# EasyEDA schematic SCH_Project-30-easy-XIAO_2026-04-27.json
TITLE: Sheet_1; REV: 1.0; Date: 2024-11-25; Sheet: 1/1; Drawn By: renatobrant; Company: Your Company
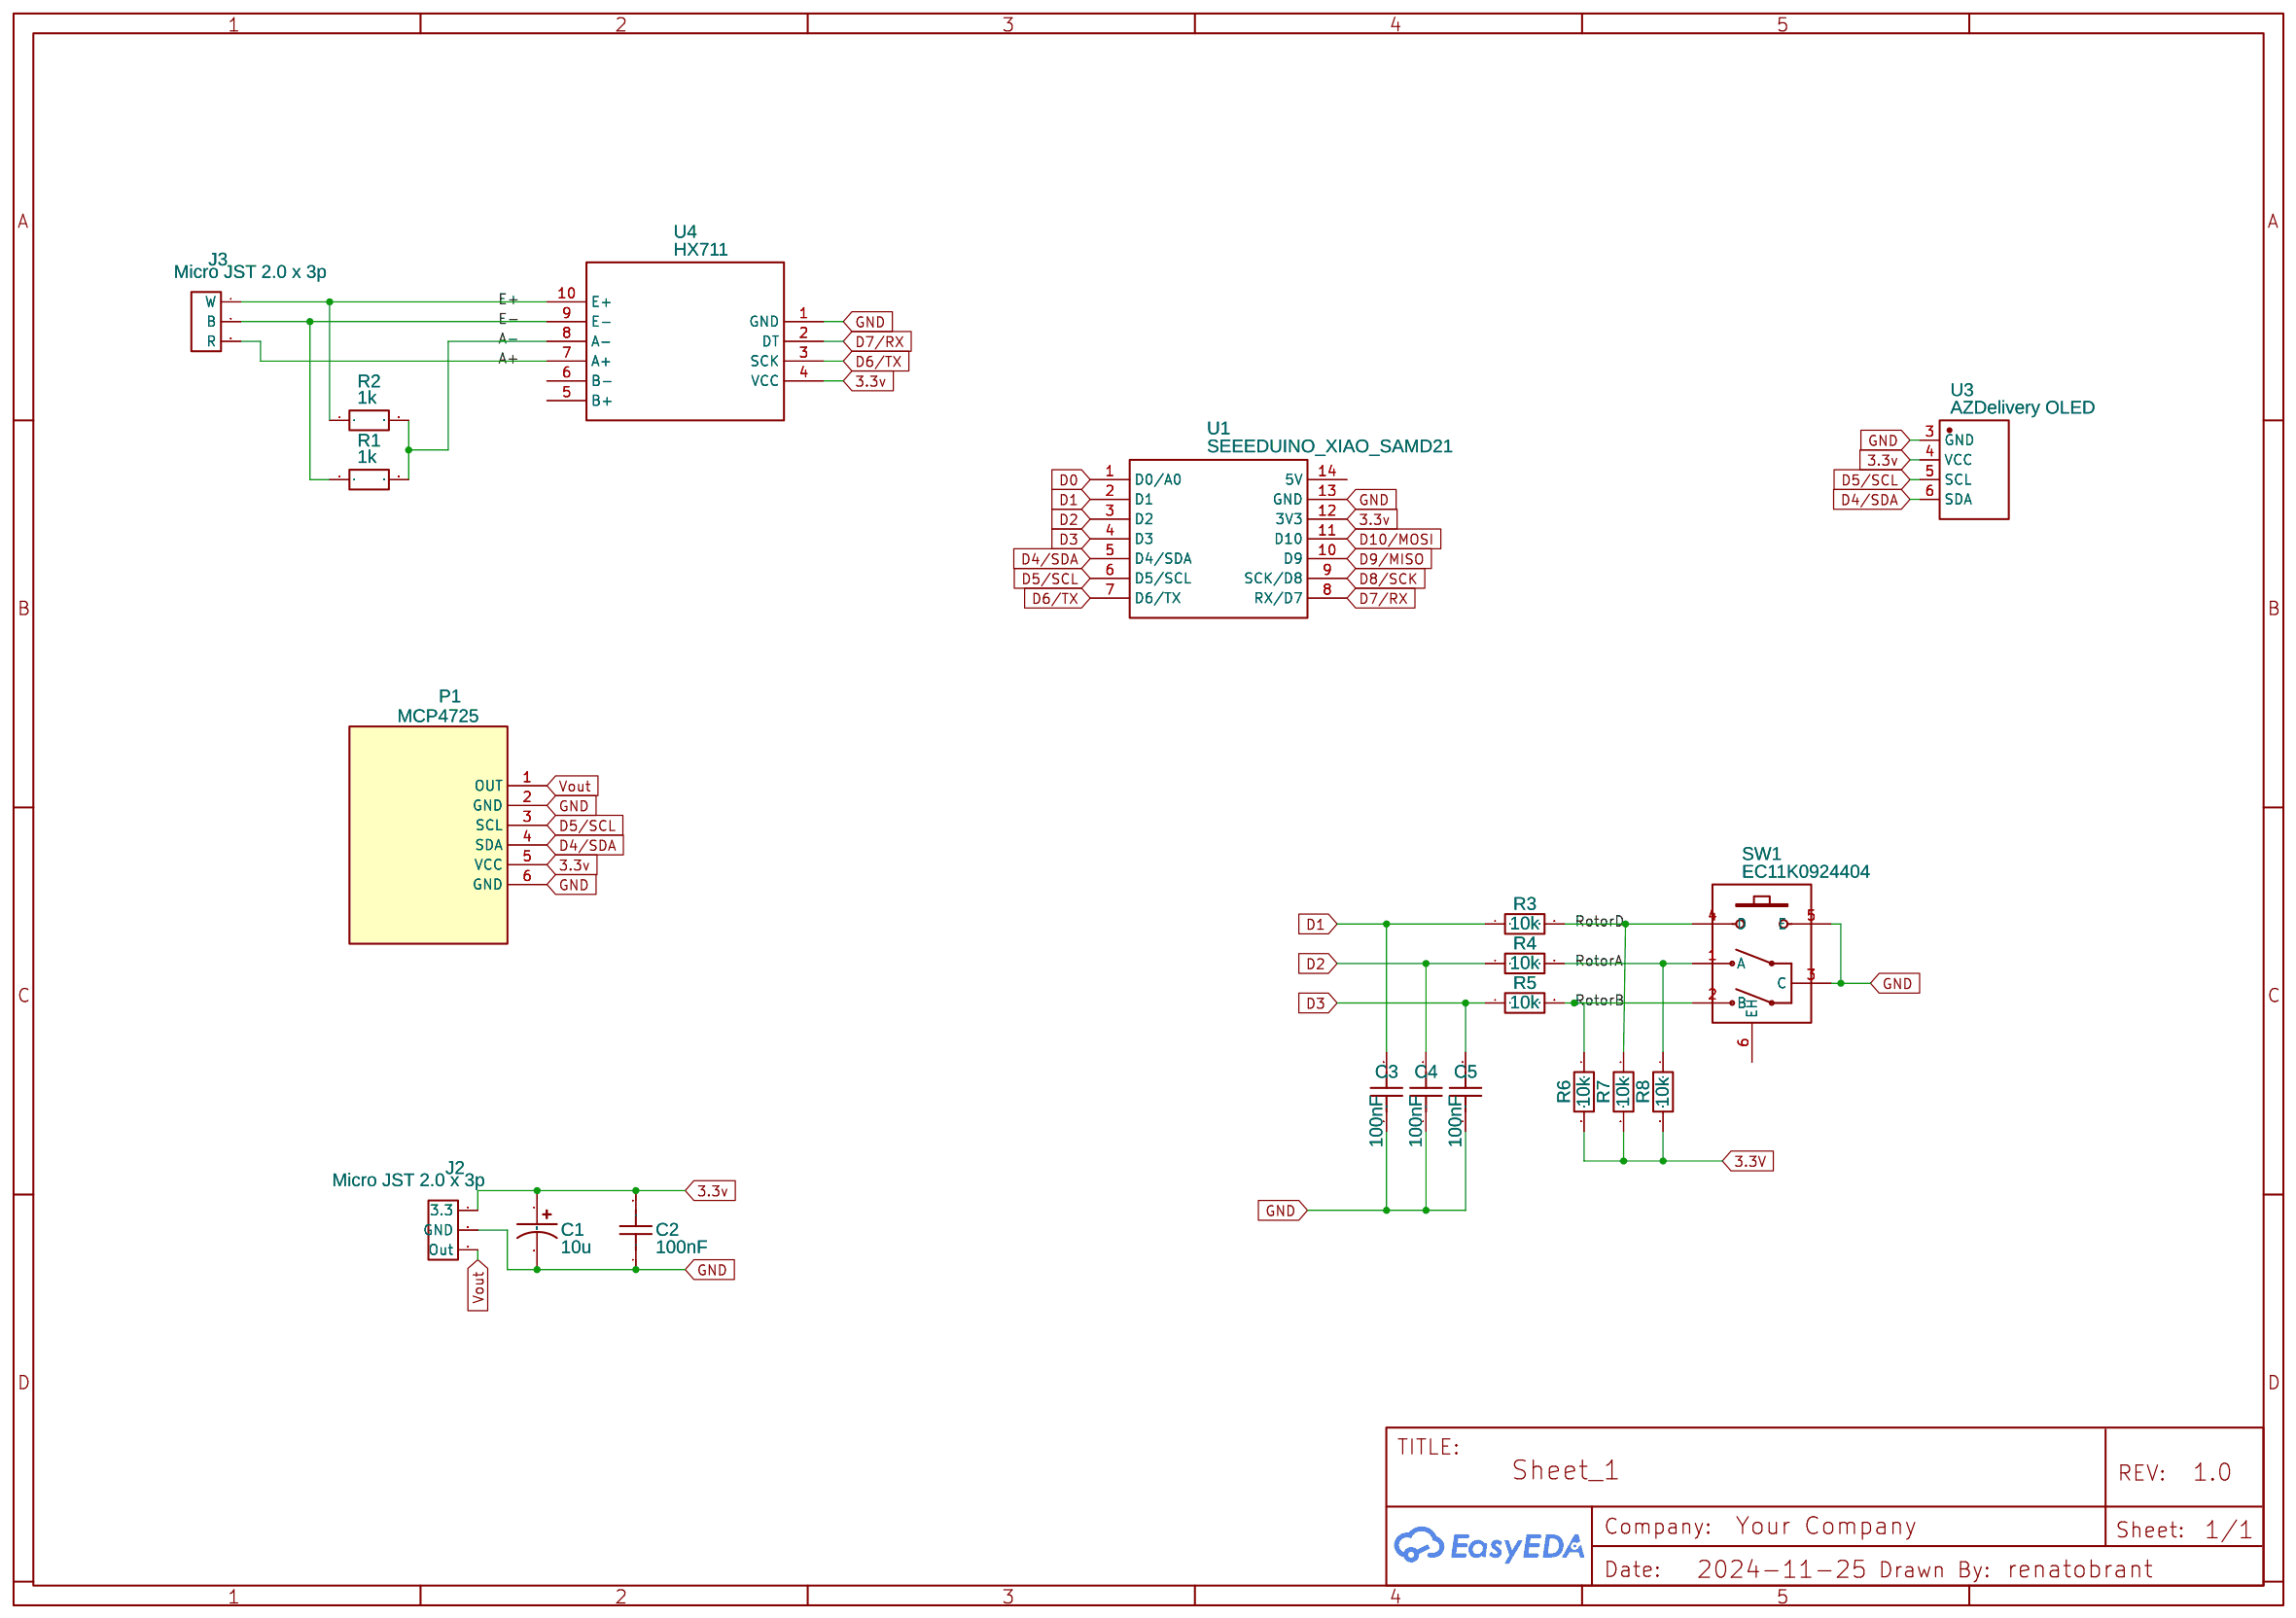
[diagram p0: schematic sheet]

## Parts
C1  10u  [CAP-D5.0×F2.0]
C2  100nF  [RAD-0.1]
C3  100nF  [RAD-0.1]
C4  100nF  [RAD-0.1]
C5  100nF  [RAD-0.1]
J2  Micro JST 2.0 x 3p  [MICRO JST2.0 X 3]
J3  Micro JST 2.0 x 3p  [MICRO JST2.0 X 3]
P1  MCP4725  [MCP4725-B]
R1  1k  [R_AXIAL-0.3]
R2  1k  [R_AXIAL-0.3]
R3  10k  [R_AXIAL-0.3]
R4  10k  [R_AXIAL-0.3]
R5  10k  [R_AXIAL-0.3]
R6  10k  [R_AXIAL-0.3]
R7  10k  [R_AXIAL-0.3]
R8  10k  [R_AXIAL-0.3]
SW1  EC11K0924404  [SW-TH_EC11K0924404]
U1  SEEEDUINO_XIAO_SAMD21  [SEEEDUINO_XIAO_SAMD21_R2]
U3  AZDelivery OLED  [OLED-TH_OLED0.96-I2C]
U4  HX711  [COMM-TH_HX711_01]

## Library data of the parts
C1 = CE_TH_D5.0×F2.0_US: Contributor: LCEDA_Lib
C2-C5 = C_RAD-0.1_US: Contributor: LCEDA_Lib
J2 J3 = Micro JST 2.0 x 3p: Contributor: BrIs1063
P1 = MCP4725 COPY: sourceId: 1T5FDZYC8
R1-R8 = R_AXIAL-0.3_EU: Contributor: LCEDA_Lib
SW1 = EC11K0924404: Contributor: LCSC; Supplier: LCSC; Supplier Part: C470743; Manufacturer: ALPSALPINE(阿尔卑斯阿尔派); JLCPCB Part Class: Extended Part
U1 = SEEEDUINO_XIAO_SAMD21: Contributor: jgm26
U3 = AZDelivery OLED: Supplier Part: AZDelivery; Manufacturer: AZDelivery; Manufacturer Part: ZJY096S0700BG01蓝色; link: https://img.jlc.com/pdf/applyPasteComponent/2022-08-15/203417A/337c2d88c1b34c958220578f8c1ccd46/ZJY096S0700WG01.pdf; Contributor: tonysandberg69
U4 = HX711: Contributor: lucasr.rbarros76

## Nets
3.3v: C1.1 C2.2 J2.1(3.3) P1.5(VCC) U1.12(3V3) U3.4(VCC) U4.4(VCC)
3.3V: R6.2 R7.2 R8.2
GND: C1.2 C2.1 C3.1 C4.1 C5.1 J2.2(GND) P1.2(GND) P1.6(GND) SW1.3(C) SW1.5(E) U1.13(GND) U3.3(GND) U4.1(GND)
A+: J3.3(R) U4.7(A+)
A-: R1.2 R2.2 U4.8(A-)
D0: U1.1(D0/A0)
D1: C3.2 R3.1 U1.2(D1)
D2: C4.2 R4.1 U1.3(D2)
D3: C5.2 R5.1 U1.4(D3)
D4/SDA: P1.4(SDA) U1.5(D4/SDA) U3.6(SDA)
D5/SCL: P1.3(SCL) U1.6(D5/SCL) U3.5(SCL)
D6/TX: U1.7(D6/TX) U4.3(SCK)
D7/RX: U1.8(RX/D7) U4.2(DT)
D8/SCK: U1.9(SCK/D8)
D9/MISO: U1.10(D9)
D10/MOSI: U1.11(D10)
E+: J3.1(W) R2.1 U4.10(E+)
E-: J3.2(B) R1.1 U4.9(E-)
RotorA: R4.2 R8.1 SW1.1(A)
RotorB: R5.2 R6.1 SW1.2(B)
RotorD: R3.2 R7.1 SW1.4(D)
Vout: J2.3(Out) P1.1(OUT)

Not connected (* = marked no-connect by the designer): SW1 6(EH); U1 14(5V); U4 5(B+) 6(B-)
